# Altium schematic sheet XIAO-log^2-2.SchDoc
size A4
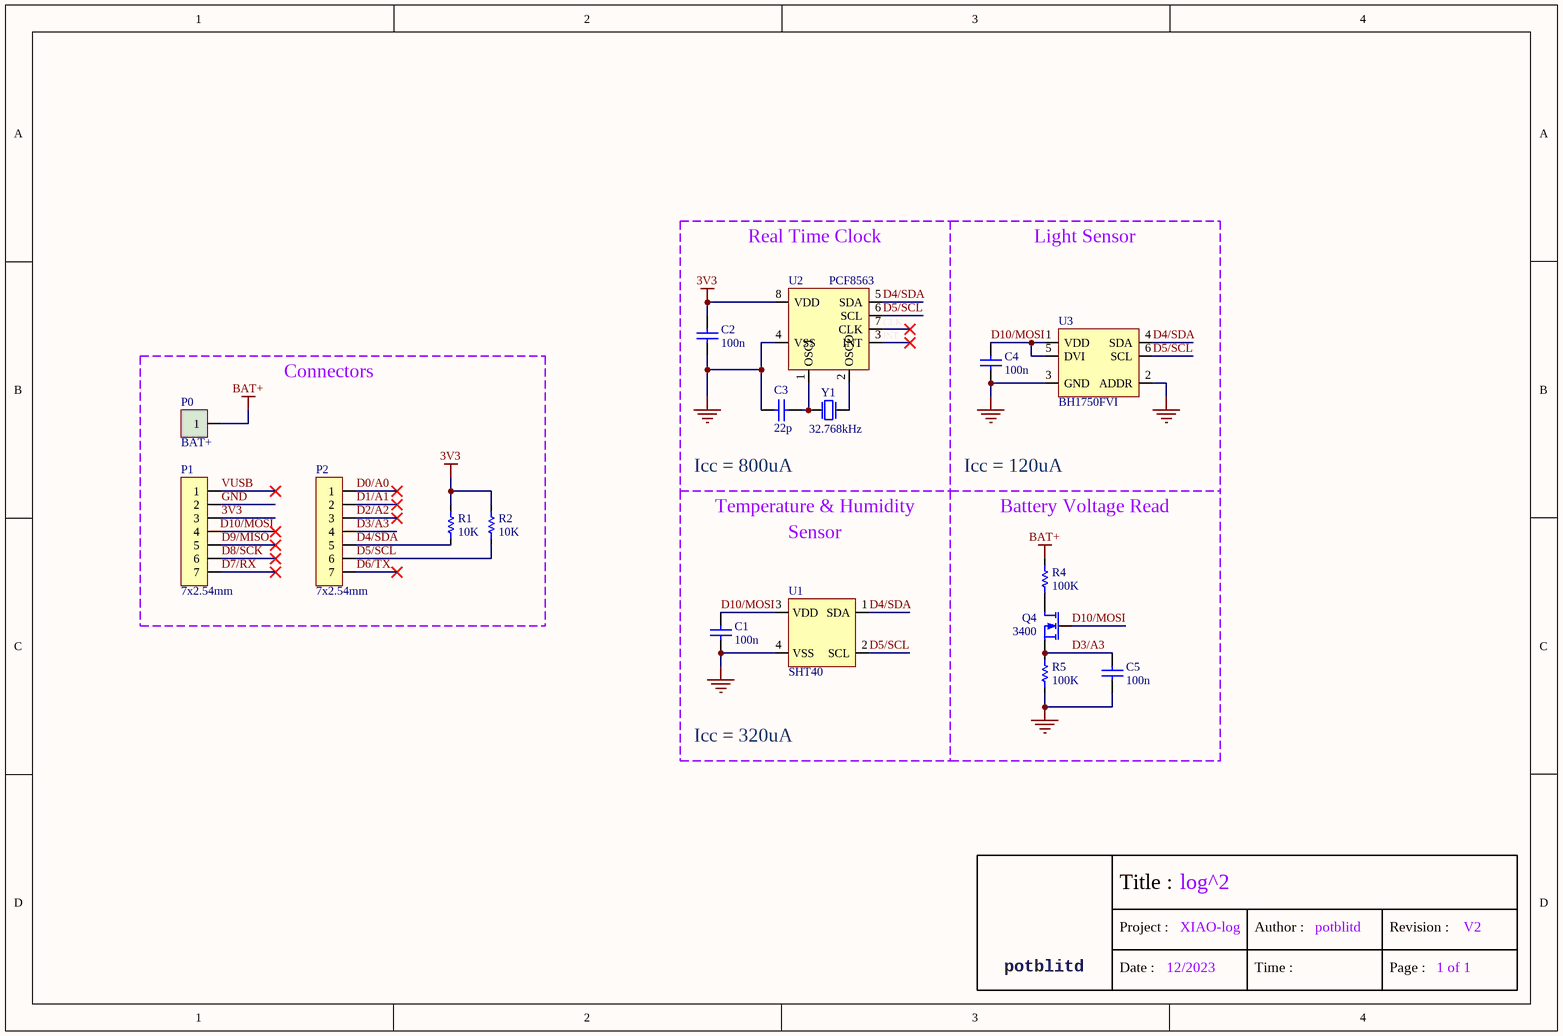
[diagram p0: XIAO-log^2-2.SchDoc]

## Parts
C1  value 100n  [0603CM]  (hidden comment: Capacitor)
C2  value 100n  [0603CM]  (hidden comment: Capacitor)
C3  value 22p  [0603CM]  (hidden comment: Capacitor)
C4  value 100n  [0603CM]  (hidden comment: Capacitor)
C5  value 100n  [0603CM]  (hidden comment: Capacitor)
P0  BAT+  [1P-2.54mm]
P1  7x2.54mm  [7P-2.54mm-nosilk]
P2  7x2.54mm  [7P-2.54mm-nosilk]
Q4  3400  [SOT23-3 M]
R1  value 10K  [0603RM]  (hidden comment: Resistor)
R2  value 10K  [0603RM]  (hidden comment: Resistor)
R4  value 100K  [0603RM]  (hidden comment: Resistor)
R5  value 100K  [0603RM]  (hidden comment: Resistor)
U1  SHT40  [DFN-4-EP(1.5x1.5) M]
U2  PCF8563  [SOP-8 M]
U3  BH1750FVI  [WSOF6 M]
Y1  value 32.768kHz  [FC135 M]  (hidden comment: Oscillator)

## Blocks framed on the sheet
Connectors: P0-P2 R1 R2

## Nets
3V3: C2.1 P1.3 R1.2 R2.2 U2.8(VDD)
BAT+: P0.1 R4.2
GND: C1.2 C2.2 C3.2 C4.2 C5.2 P1.2 R5.1 U1.4(VSS) U2.4(VSS) U3.2(ADDR) U3.3(GND)
CLK: U2.7(CLK)
D0/A0: P2.1
D1/A1: P2.2
D2/A2: P2.3
D3/A3: C5.1 P2.4 Q4.2(S) R5.2
D4/SDA: P2.5 R1.1 U1.1(SDA) U2.5(SDA) U3.4(SDA)
D5/SCL: P2.6 R2.1 U1.2(SCL) U2.6(SCL) U3.6(SCL)
D6/TX: P2.7
D7/RX: P1.7
D8/SCK: P1.6
D9/MISO: P1.5
D10/MOSI: C1.1 C4.1 P1.4 Q4.1(G) U1.3(VDD) U3.1(VDD) U3.5(DVI)
INT: U2.3(INT)
VUSB: P1.1
NetC3_1: C3.1 U2.1(OSCI) Y1.2
NetQ4_3: Q4.3(D) R4.1
NetU2_2: U2.2(OSCO) Y1.1

## Notes on the sheet
- Real Time Clock
- Light Sensor
- Icc = 800uA
- Temperature & Humidity
- Icc = 120uA
- (near R4) Battery Voltage Read
- Sensor
- Icc = 320uA
- Title :
- log^2
- potblitd
- Project :
- Date :
- 12/2023
- XIAO-log
- Author :
- Time :
- Revision :
- Page :
- 1 of 1
- V2

## Library data of the parts
C1 C2 C4 = Capacitor: Capacitor 100nF ±10% 50V; Component: CL05B104KB54PNC
C3 = Capacitor: Capacitor 22pF ±5% 50V; Component: 0402CG220J500NT
C5 = Capacitor: Capacitor 100nF ±10% 50V; Component: CC0603KRX7R9BB104; JLC Code: C14663
P0 = 1-pin Header: General 2-pin connection; Function: BAT CON
P1 P2 = 7-pins Header: General 7-pin connection; Function: XIAO CON
Q4 = MOSFET-N: MOSFET N-channel 30V 5.7A; Component: AO3400A; Function: VBAT-ADC enable; Value: N-FET; JLC Code: C20917
R1 = Resistor: Resistor 10kΩ ±1% 1/16W; Component: 0402WGF1002TCE; Function: SDA pull-up
R2 = Resistor: Resistor 10kΩ ±1% 1/16W; Component: 0402WGF1002TCE; Function: SCL pull-up
R4 R5 = Resistor: Resistor 100kΩ ±1% 100mW; Component: 0603WAF1003T5E; JLC Code: C25803
U1 = SHT40: SHT40 temperature and humidity sensor; Component: SHT40-AD1B-R2; Function: T&H sensor
U2 = RTC-8563: IC real-time clock with alarm interrupt; Component: PCF8563T/5,518; Function: RTC
U3 = BH1750: Digital light sensor; Function: lux sensor; Component: BH1750FVI
Y1 = XO-2: Crystal oscillator 32.768kHz 20ppm 12.5pF; Component: Q13FC1350000400; Function: RTC XO